# EAGLE design Stroya_Stompbox (EAGLE 9.5.2)
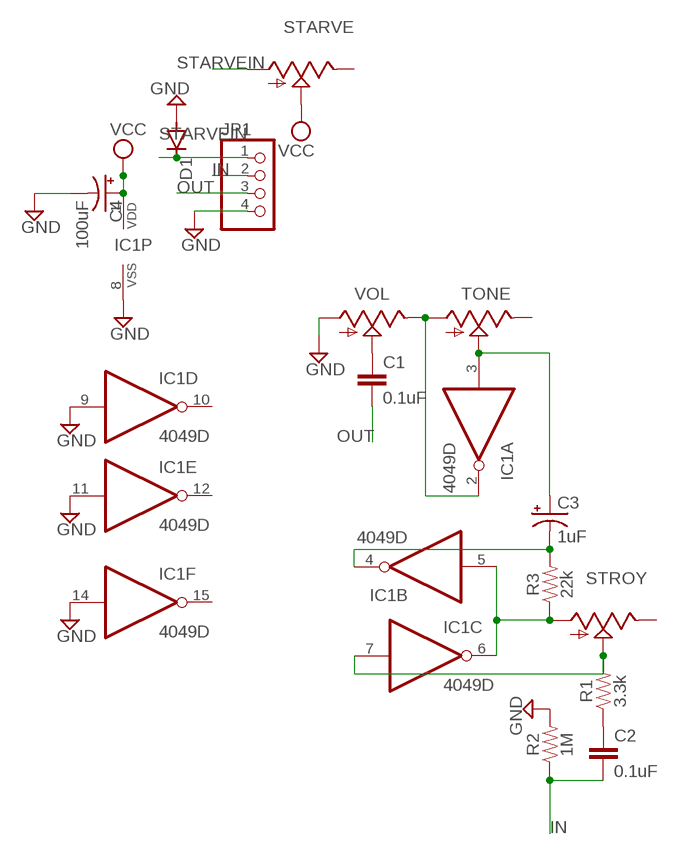
[diagram p0: schematic, sheet 1]

## Parts
C1  0.1uF  0.1UF-0603-25V-5%  [0603]
C2  0.1uF  0.1UF-0603-25V-5%  [0603]
C3  1uF  CAP_SMD+THRUPAN_B  [PAN_B_SMD+THRU]
C4  100uF  CAP_SMD+THRUPAN_B  [PAN_B_SMD+THRU]
D1  DIODE-SOD123  [SOD123]
IC1  4049D  [SO16]
JP1  PINHD-1X4  [1X04]
R1  3.3k  3.3KOHM-0603-1/10W-1%  [0603]
R2  1M  1MOHM-0603-1/4W-5%  [0603]
R3  22k  22KOHM-0603-1/10W-1%  [0603]
STARVE  9MM_SNAP-IN_POT_  [9MM_SNAP-IN_POT]
STROY  9MM_SNAP-IN_POT_  [9MM_SNAP-IN_POT]
TONE  9MM_SNAP-IN_POT_  [9MM_SNAP-IN_POT]
VOL  9MM_SNAP-IN_POT_  [9MM_SNAP-IN_POT]

## Nets
GND: C4.- C4.--(-) D1.A IC1.8(P:VSS) IC1.9(D:I) IC1.11(E:I) IC1.14(F:I) JP1.4 R2.2 VOL.1(A)
IN: C2.2 JP1.2 R2.1
N$1: C2.1 R1.1
N$2: IC1.7(C:I) R1.2 STROY.2(S)
N$3: IC1.5(B:I) IC1.6(C:O) R3.1 STROY.1(A)
N$4: C3.+ C3.++(+) IC1.3(A:I) TONE.2(S)
N$5: IC1.2(A:O) TONE.1(A) VOL.3(E)
N$6: C1.1 VOL.2(S)
N$7: C3.- C3.--(-) IC1.4(B:O) R3.2
OUT: C1.2 JP1.3
STARVEIN: D1.C JP1.1 STARVE.1(A)
VCC: C4.+ C4.++(+) IC1.1(P:VDD) STARVE.2(S)
Unconnected: IC1.10(D:O) IC1.12(E:O) IC1.15(F:O) STARVE.3(E) STROY.3(E) TONE.3(E)

## Library data of the parts
C1 C2 = SparkFun-Capacitors:0.1UF: 0.1µF ceramic capacitors A capacitor is a passive two-terminal electrical component used to store electrical energy temporarily in an electric field.; PROD_ID: CAP-08604
C3 C4 = MusicThingModular:CAP_SMD+THRU
D1 = diode:DIODE-: DIODE
IC1 = 40xx:4049: Hex inverting BUFFER
JP1 = Connector:PINHD-1X4: PIN HEADER; CATEGORY: CONNECTOR; SUB-CATEGORY: PIN-HEADER
R1 = SparkFun-Resistors:3.3KOHM: 3.3kΩ resistor A resistor is a passive two-terminal electrical component that implements electrical resistance as a circuit element. Resistors act to reduce current flow, and, at the same time, act to lower voltage levels within circuits. - Wikipedia; PROD_ID: RES-07851
R2 = SparkFun-Resistors:1MOHM: 1MΩ resistor A resistor is a passive two-terminal electrical component that implements electrical resistance as a circuit element. Resistors act to reduce current flow, and, at the same time, act to lower voltage levels within circuits. - Wikipedia; PROD_ID: RES-07868
R3 = SparkFun-Resistors:22KOHM: 22kΩ resistor A resistor is a passive two-terminal electrical component that implements electrical resistance as a circuit element. Resistors act to reduce current flow, and, at the same time, act to lower voltage levels within circuits. - Wikipedia; PROD_ID: RES-07853
STARVE STROY TONE VOL = MusicThingModular:9MM_SNAP-IN_POT: 9mm vertical snap-in pot, Alpha / Panasonic style

## Board
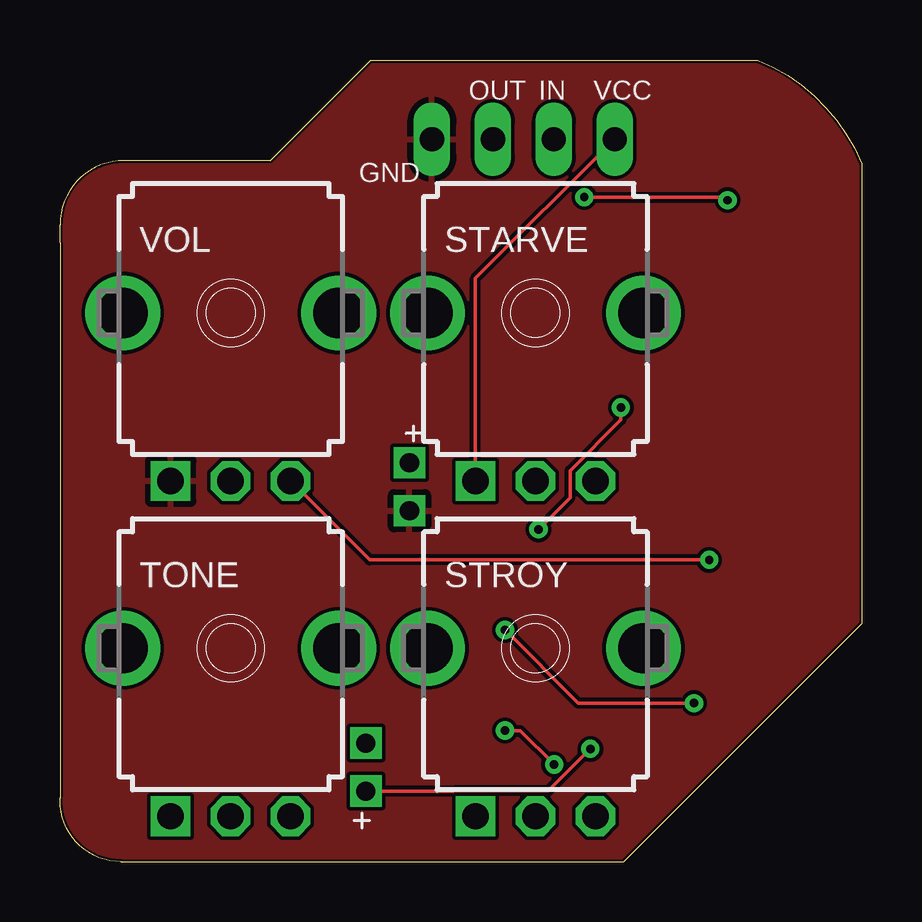
[diagram p1: board, top side]
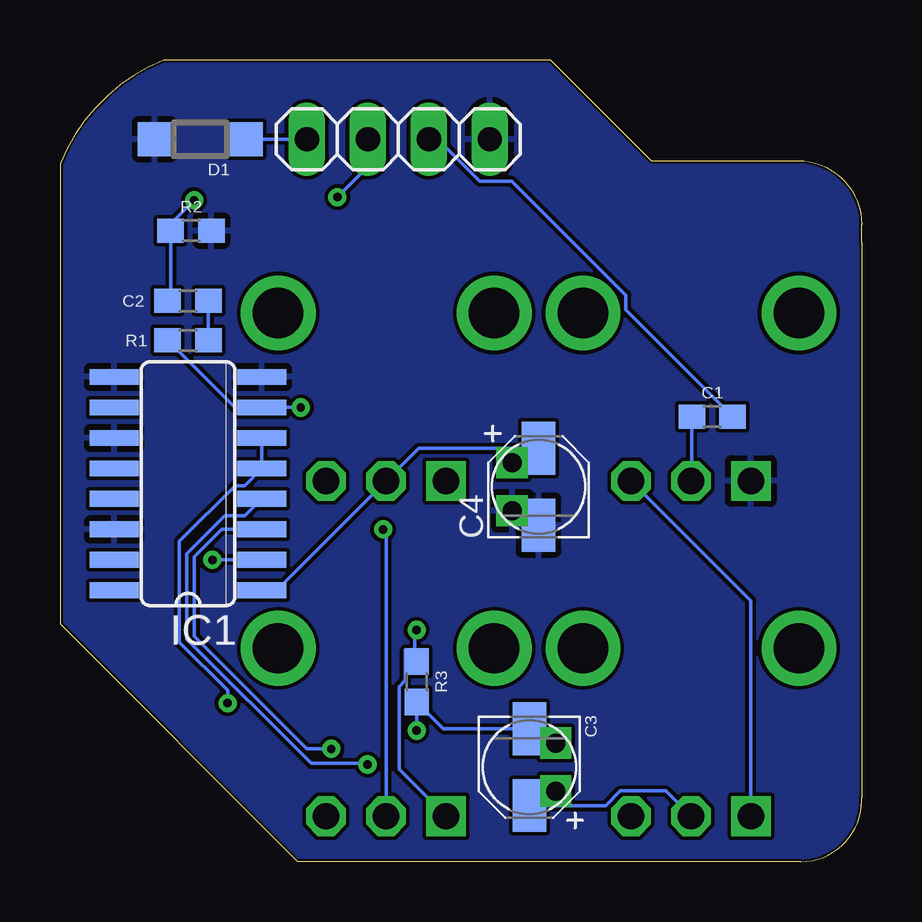
[diagram p2: board, bottom side, seen from below]

Size 33.4 x 33.4 mm. Coordinates in mm from the lower left corner, seen from the top.
Outline: 2.54,0 23.5,0 33.4,9.91 33.4,29.08 arc45 29.08,33.4 12.95,33.4 8.76,29.21 2.67,29.21 arc90 0,26.54 0,25.78 0,2.67 0,2.54 arc90 2.54,0
Copper layers (1*16): Top 0.035mm / dielectric 1.5mm / Bottom 0.035mm
Design rules "default *": minimum track width 6mil, minimum drill 0.35mm, track to track 6mil, track to pad 6mil, pad to pad 6mil, via to via 6mil, smd to smd 6mil, copper to edge 4mil, drill to drill 6mil, minimum pad ring 10mil, minimum via ring 8mil, stop-mask expansion 4mil, vias tented up to drill 0mil, thermal gap 10mil

### Footprints (pad centres in the part's own frame; a part is rotated, then mirrored left to right if it is on the bottom)
0603 = smd 1.1 x 1: 1 -0.85,0; 2 0.85,0
PAN_B_SMD+THRU = smd 2.2 x 1.4: + 1.6,0; - -1.6,0 | drill 0.8 pad 0.9 square: ++ 1,1.1; -- -1,1.1
SOD123 = smd 1.4 x 1.4: A 1.9,0; C -1.9,0
SO16 = smd 0.66 x 2.032: 1 -4.445,-3.073; 2 -3.175,-3.073; 3 -1.905,-3.073; 4 -0.635,-3.073; 5 0.635,-3.073; 6 1.905,-3.073; 7 3.175,-3.073; 8 4.445,-3.073; 9 4.445,3.073; 10 3.175,3.073; 11 1.905,3.073; 12 0.635,3.073; 13 -0.635,3.073; 14 -1.905,3.073; 15 -3.175,3.073; 16 -4.445,3.073
1X04 = drill 1.016 long: 1 -3.81,0; 2 -1.27,0; 3 1.27,0; 4 3.81,0
9MM_SNAP-IN_POT = drill 1.1 square: 1 -2.5,-7 | drill 1.1 octagon: 2 0,-7; 3 2.5,-7 | drill 2.1 pad 2.794: CHASSIS1 -4.5,0; CHASSIS2 4.5,0

### Placement (x,y rotation side)
C1  6.22,18.54 0 bottom
C2  28.07,23.37 180 bottom
C3  13.84,3.94 270 bottom
C4  13.46,15.62 90 bottom
D1  27.56,30.1 180 bottom
IC1  28.07,15.75 90 bottom
JP1  19.3,30.1 0 bottom
R1  28.07,21.72 180 bottom
R2  27.94,26.29 0 bottom
R3  18.54,7.49 270 bottom
STARVE  19.81,22.86 0 top
STROY  19.81,8.89 0 top
TONE  7.11,8.89 0 top
VOL  7.11,22.86 0 top

### Tracks (layer width: path | path; a pad name or v marks a point on that pad's centre or on a via)
GND
  pour Bottom: 0,0 33.4,0 33.4,33.4 0.13,33.4 0,33.27
  pour Top (isolate 0.012): 0,33.4 0,0 33.53,0 33.53,33.53 0,33.53
IN  (via drill 0.35)
  Top 0.152: v21.84,27.69 27.69,27.69 v27.81,27.56
  Bottom 0.152: JP1.2 20.57,28.96 v21.84,27.69 | v27.81,27.56 28.79,26.58 R2.1 28.79,23.5 C2.2
N$1
  Bottom 0.152: C2.1 R1.1
N$2  (via drill 0.35)
  Top 0.152: v19.94,13.84 21.26,15.16 21.26,16.3 23.37,18.41 v23.37,18.92
  Bottom 0.152: R1.2 26.12,18.92 IC1.7 v23.37,18.92 | STROY.2 19.81,13.72 v19.94,13.84
N$3  (via drill 0.35)
  Top 0.152: v26.42,6.6 21.59,6.6 v18.54,9.65
  Bottom 0.152: IC1.6 IC1.5 25.7,15.67 26.1,15.67 28.42,13.35 28.42,9.14 26.42,7.14 v26.42,6.6 | 18.62,8.43 19.01,8.81 19.01,7.55 19.27,7.29 19.27,3.85 STROY.1 | 18.62,8.43 R3.1 | v18.54,9.65 18.62,9.57 18.62,8.43
N$4  (via drill 0.35)
  Top 0.152: C3.++ 16.39,2.94 20.34,2.94 v22.1,4.7
  Bottom 0.152: C3.++ 13.34,2.34 C3.+ 10.65,2.34 10.05,2.94 8.17,2.94 TONE.2 | IC1.3 26.67,13.84 27.81,12.7 27.81,9.4 23.11,4.7 v22.1,4.7
N$5  (via drill 0.35)
  Top 0.152: v27.05,12.57 12.9,12.57 VOL.3
  Bottom 0.152: IC1.2 v27.05,12.57 | TONE.1 4.61,10.86 VOL.3
N$6
  Bottom 0.152: VOL.2 7.07,15.9 C1.1
N$7  (via drill 0.35)
  Top 0.152: v20.59,4.05 19.18,5.46 v18.54,5.46
  Bottom 0.152: C3.-- 13.24,4.94 C3.- 17.44,5.54 R3.2 v18.54,5.46 | IC1.4 25.7,14.4 26.54,14.4 28.12,12.83 28.12,9.27 22.94,4.09 20.63,4.09 v20.59,4.05
OUT
  Bottom 0.152: C1.2 9.82,22.99 9.82,23.6 14.57,28.35 15.9,28.35 17.66,30.1 JP1.3
STARVEIN
  Top 0.152: STARVE.1 17.31,24.3 JP1.1
  Bottom 0.152: JP1.1 D1.C
VCC
  Bottom 0.152: C4.++ 13.96,17.22 C4.+ 18.45,17.22 STARVE.2 24.37,11.3 IC1.1

### Text on the board
tPlace: OUT | IN | VCC | GND